# Altium schematic sheet PART_2.SchDoc
size A4
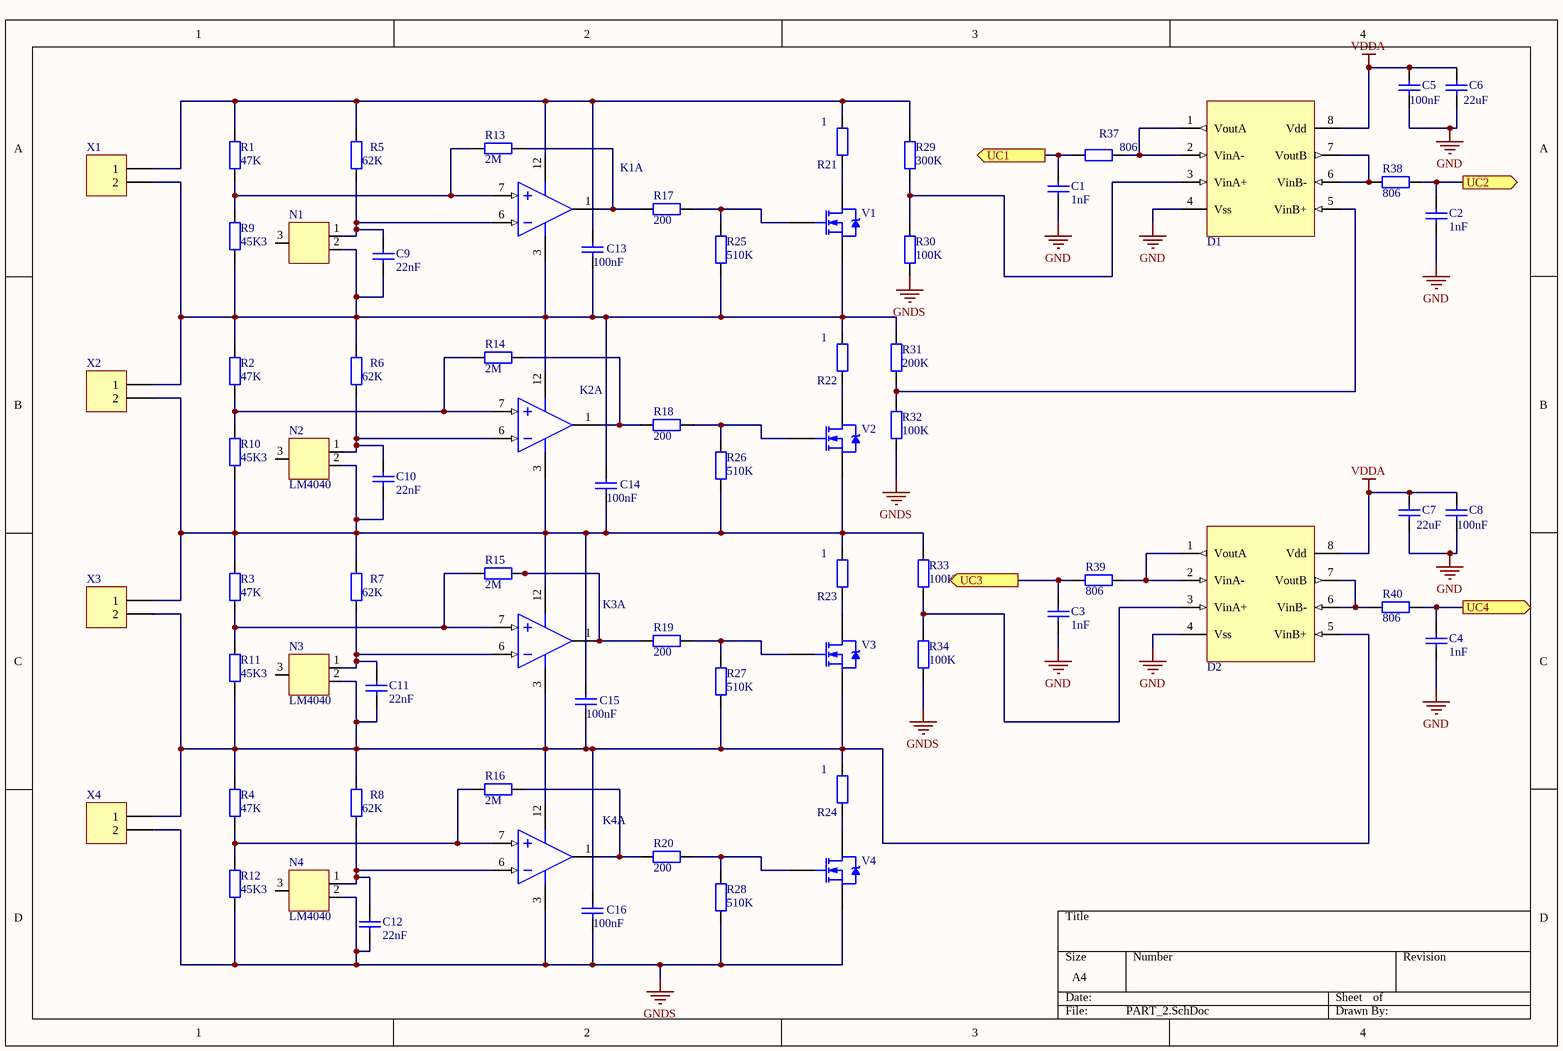
[diagram p0: PART_2.SchDoc]

## Parts
C1  value 1nF  [C0805]  (hidden comment: Cap)
C2  value 1nF  [C0805]  (hidden comment: Cap)
C3  value 1nF  [C0805]  (hidden comment: Cap)
C4  value 1nF  [C0805]  (hidden comment: Cap)
C5  100nF  [C0805]
C6  22uF  [C0805]
C7  22uF  [C0805]
C8  100nF  [C0805]
C9  value 22nF  [C0805]  (hidden comment: Cap)
C10  value 22nF  [C0805]  (hidden comment: Cap)
C11  value 22nF  [C0805]  (hidden comment: Cap)
C12  value 22nF  [C0805]  (hidden comment: Cap)
C13  value 100nF  [C0805]  (hidden comment: Cap)
C14  value 100nF  [C0805]  (hidden comment: Cap)
C15  value 100nF  [C0805]  (hidden comment: Cap)
C16  value 100nF  [C0805]  (hidden comment: Cap)
D1  (no value)  [MSOP za op.pojacalo]
D2  (no value)  [MSOP za op.pojacalo]
K1  TLC3704QJ  [TSSOP5-3]  (value not drawn)  (part A of 4)
K2  TLC3704QJ  [TSSOP5-3]  (value not drawn)  (part A of 4)
K3  TLC3704QJ  [TSSOP5-3]  (value not drawn)  (part A of 4)
K4  TLC3704QJ  [TSSOP5-3]  (value not drawn)  (part A of 4)
N1  (no value)  [SOT-23-ref_chip]
N2  LM4040  [SOT-23-ref_chip]
N3  LM4040  [SOT-23-ref_chip]
N4  LM4040  [SOT-23-ref_chip]
R1  47K  [C0805]
R2  47K  [C0805]
R3  47K  [C0805]
R4  47K  [C0805]
R5  62K  [C0805]
R6  62K  [C0805]
R7  62K  [C0805]
R8  62K  [C0805]
R9  45K3  [C0805]
R10  45K3  [C0805]
R11  45K3  [C0805]
R12  45K3  [C0805]
R13  2M  [C0805]
R14  2M  [C0805]
R15  2M  [C0805]
R16  2M  [C0805]
R17  200  [C0805]
R18  200  [C0805]
R19  200  [C0805]
R20  200  [C0805]
R21  1  [F za 7W otpornik]
R22  1  [F za 7W otpornik]
R23  1  [F za 7W otpornik]
R24  1  [F za 7W otpornik]
R25  510K  [C0805]
R26  510K  [C0805]
R27  510K  [C0805]
R28  510K  [C0805]
R29  300K  [C0805]
R30  100K  [C0805]
R31  200K  [C0805]
R32  100K  [C0805]
R33  100K  [C0805]
R34  100K  [C0805]
R37  806  [C0805]
R38  806  [C0805]
R39  806  [C0805]
R40  806  [C0805]
V1  NMOS-2  [sot23_transistors]  (value not drawn)
V2  NMOS-2  [sot23_transistors]  (value not drawn)
V3  NMOS-2  [sot23_transistors]  (value not drawn)
V4  NMOS-2  [sot23_transistors]  (value not drawn)
X1  Header 2  [F Header 1x2]  (value not drawn)
X2  Header 2  [F Header 1x2]  (value not drawn)
X3  Header 2  [F Header 1x2]  (value not drawn)
X4  Header 2  [F Header 1x2]  (value not drawn)

## Ports
UC1 (out), UC2 (out), UC3 (out), UC4 (out)

## Nets
GND: C1.1 C2.1 C3.1 C4.1 C5.1 C6.1 C7.1 C8.1 D1.4(Vss) D2.4(Vss)
GNDS: C12.1 C16.2 K4.3(V+) N4.2 R12.1 R28.1 R30.1 R32.1 R34.1 V4.3(S) X4.2
VDDA: C5.2 C6.2 C7.2 C8.2 D1.8(Vdd) D2.8(Vdd)
UC1: C1.2 R37.2 ; port UC1
UC2: C2.2 R38.2 ; port UC2
UC3: C3.2 R39.1 ; port UC3
UC4: C4.2 R40.2 ; port UC4
NetC9_1: C9.1 C13.2 C14.1 K1.3(V+) K2.12(V-) N1.2 R2.2 R6.2 R9.1 R22.2 R25.1 R31.2 V1.3(S) X1.2 X2.1
NetC9_2: C9.2 K1.6(IN-) N1.1 R5.1
NetC10_1: C10.1 C14.2 C15.1 K2.3(V+) K3.12(V-) N2.2 R3.2 R7.2 R10.1 R23.2 R26.1 R33.2 V2.3(S) X2.2 X3.1
NetC10_2: C10.2 K2.6(IN-) N2.1 R6.1
NetC11_1: C11.1 C15.2 C16.1 D2.5(VinB+) K3.3(V+) K4.12(V-) N3.2 R4.2 R8.2 R11.1 R24.2 R27.1 V3.3(S) X3.2 X4.1
NetC11_2: C11.2 K3.6(IN-) N3.1 R7.1
NetC12_2: C12.2 K4.6(IN-) N4.1 R8.1
NetC13_1: C13.1 K1.12(V-) R1.2 R5.2 R21.2 R29.2 X1.1
NetD1_1: D1.1(VoutA) D1.2(VinA-) R37.1
NetD1_3: D1.3(VinA+) R29.1 R30.2
NetD1_5: D1.5(VinB+) R31.1 R32.2
NetD1_6: D1.6(VinB-) D1.7(VoutB) R38.1
NetD2_1: D2.1(VoutA) D2.2(VinA-) R39.2
NetD2_3: D2.3(VinA+) R33.1 R34.2
NetD2_6: D2.6(VinB-) D2.7(VoutB) R40.1
NetK1_1: K1.1(OUT) R13.1 R17.2
NetK1_7: K1.7(IN+) R1.1 R9.2 R13.2
NetK2_1: K2.1(OUT) R14.1 R18.2
NetK2_7: K2.7(IN+) R2.1 R10.2 R14.2
NetK3_1: K3.1(OUT) R15.1 R19.2
NetK3_7: K3.7(IN+) R3.1 R11.2 R15.2
NetK4_1: K4.1(OUT) R16.1 R20.2
NetK4_7: K4.7(IN+) R4.1 R12.2 R16.2
NetR17_1: R17.1 R25.2 V1.1(G)
NetR18_1: R18.1 R26.2 V2.1(G)
NetR19_1: R19.1 R27.2 V3.1(G)
NetR20_1: R20.1 R28.2 V4.1(G)
NetR21_1: R21.1 V1.2(D)
NetR22_1: R22.1 V2.2(D)
NetR23_1: R23.1 V3.2(D)
NetR24_1: R24.1 V4.2(D)

Not connected (* = marked no-connect by the designer): N1 3; N2 3; N3 3; N4 3

## Library data of the parts
C1-C4 = Cap: Capacitor; cijena (funte): 0.127; dobavljač: Farnell; kataloški broj: 2496935; opis komponente: capacitor 1nF
C5 C8 C13-C16 = Cap: Capacitor; dobavljač: Farnell; kataloški broj: 317676RL; opis komponente: capacitor 100nF
  C5 C8: Value: 100nF
C6 C7 = Cap: Capacitor; dobavljač: Farnell; kataloški broj: 2672185; opis komponente: capacitor 22uF; Value: 22uF
C9-C12 = Cap: Capacitor
D1 D2 = Amplifier: cijena (funte): 0.29; dobavljač: Farnell; kataloški broj: 1840875; opis komponente: Operational Amplifier
K1-K4 = LP2901D: Low Power Quad Differential Comparator; cijena (funte): 0.325; dobavljač: Farnell; kataloški broj: 2164804; opis komponente: Analogue Comparator
N1-N4 = referentni chip: cijena (funte): 0.567; dobavljač: Farnell; kataloški broj: 2511278; opis komponente: chip za ref napon; Value: 1.25V
R1-R4 = Res2: Resistor; cijena (funte): 0.172; dobavljač: Farnell; kataloški broj: 1577628; opis komponente: resistor, 0.1%, 100mW; Value: 47K
R5-R8 = Res2: Resistor; cijena (funte): 0.0452; dobavljač: Farnell; kataloški broj: 2303733; opis komponente: resistor, 1%; Value: 62K
R9-R12 = Res2: Resistor; cijena (funte): 0.0173; dobavljač: Farnell; kataloški broj: 2073774; opis komponente: resistor, 125 mW, 1%; Value: 45K3
R13-R16 = Res2: Resistor; cijena (funte): 0.0106; dobavljač: Farnell; kataloški broj: 2447628; opis komponente: resistor, 125mW; Value: 2M
R17-R20 = Res2: Resistor; cijena (funte): 0.084; dobavljač: Farnell; kataloški broj: 9334076; opis komponente: resistor, 100mW; Value: 200
R21-R24 = Res2: Resistor; dobavljač: Farnell; kataloški broj: 1292518; cijena (funte): 0.426; opis komponente: Through Hole Resistor 7W; Value: 1
R25-R28 = Res2: Resistor; cijena (funte): 0.0086; dobavljač: Farnell; kataloški broj: 2447678; opis komponente: rsistor, 125mW; Value: 510K
R29 = Res2: Resistor; cijena (funte): 0.0049; dobavljač: Farnell; kataloški broj: 2447330; Value: 300K; opis komponente: resistor
R30 R32-R34 = Res2: Resistor; cijena (funte): 0.326; dobavljač: Farnell; kataloški broj: 1697458; Value: 100K; opis komponente: resistor
R31 = Res2: Resistor; dobavljač: Farnell; Value: 200K; opis komponente: resistor
R37-R40 = Res2: Resistor; cijena (funte): 0.0452; dobavljač: Farnell; kataloški broj: 2303540; Value: 806; opis komponente: resistor
V1-V4 = NMOS-2: N-Channel Power MOSFET; cijena (funte): 0.388; dobavljač: Farnell; kataloški broj: 2396085; opis komponente: N-MOSFET
X1-X4 = Header 2: Header, 2-Pin; cijena (funte): 0.239; dobavljač: Farnell; kataloški broj: 2396251; opis komponente: Header, 2-Pin